# EAGLE design Omnetics resistor phantom (EAGLE 7.2.0)
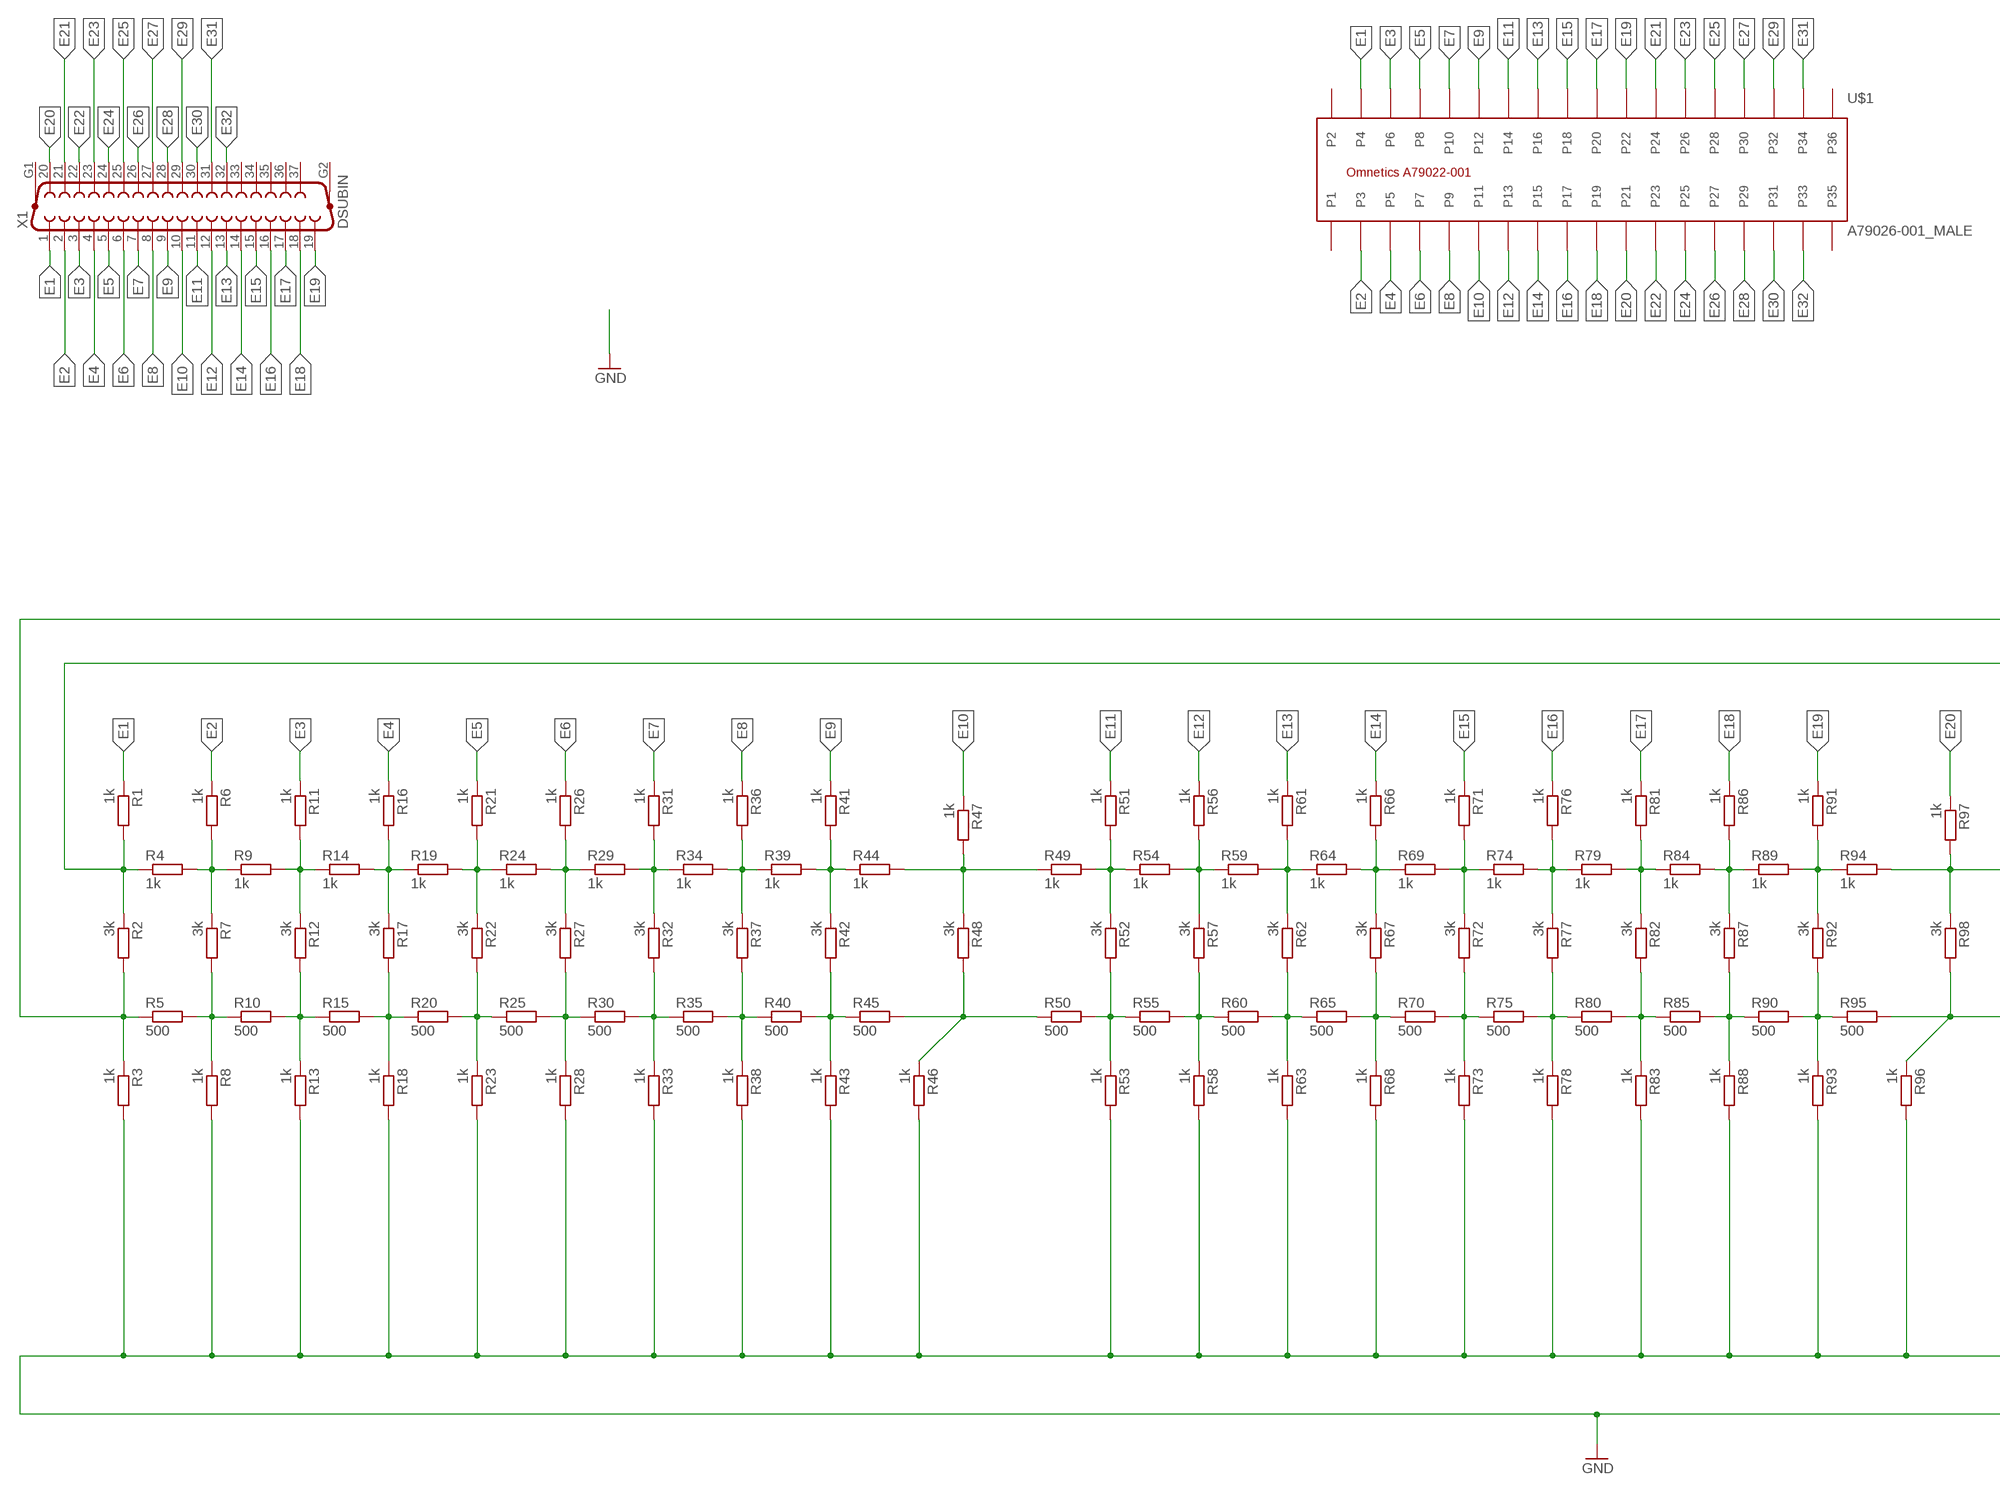
[diagram p0: schematic, sheet 1, part 1 of 2]
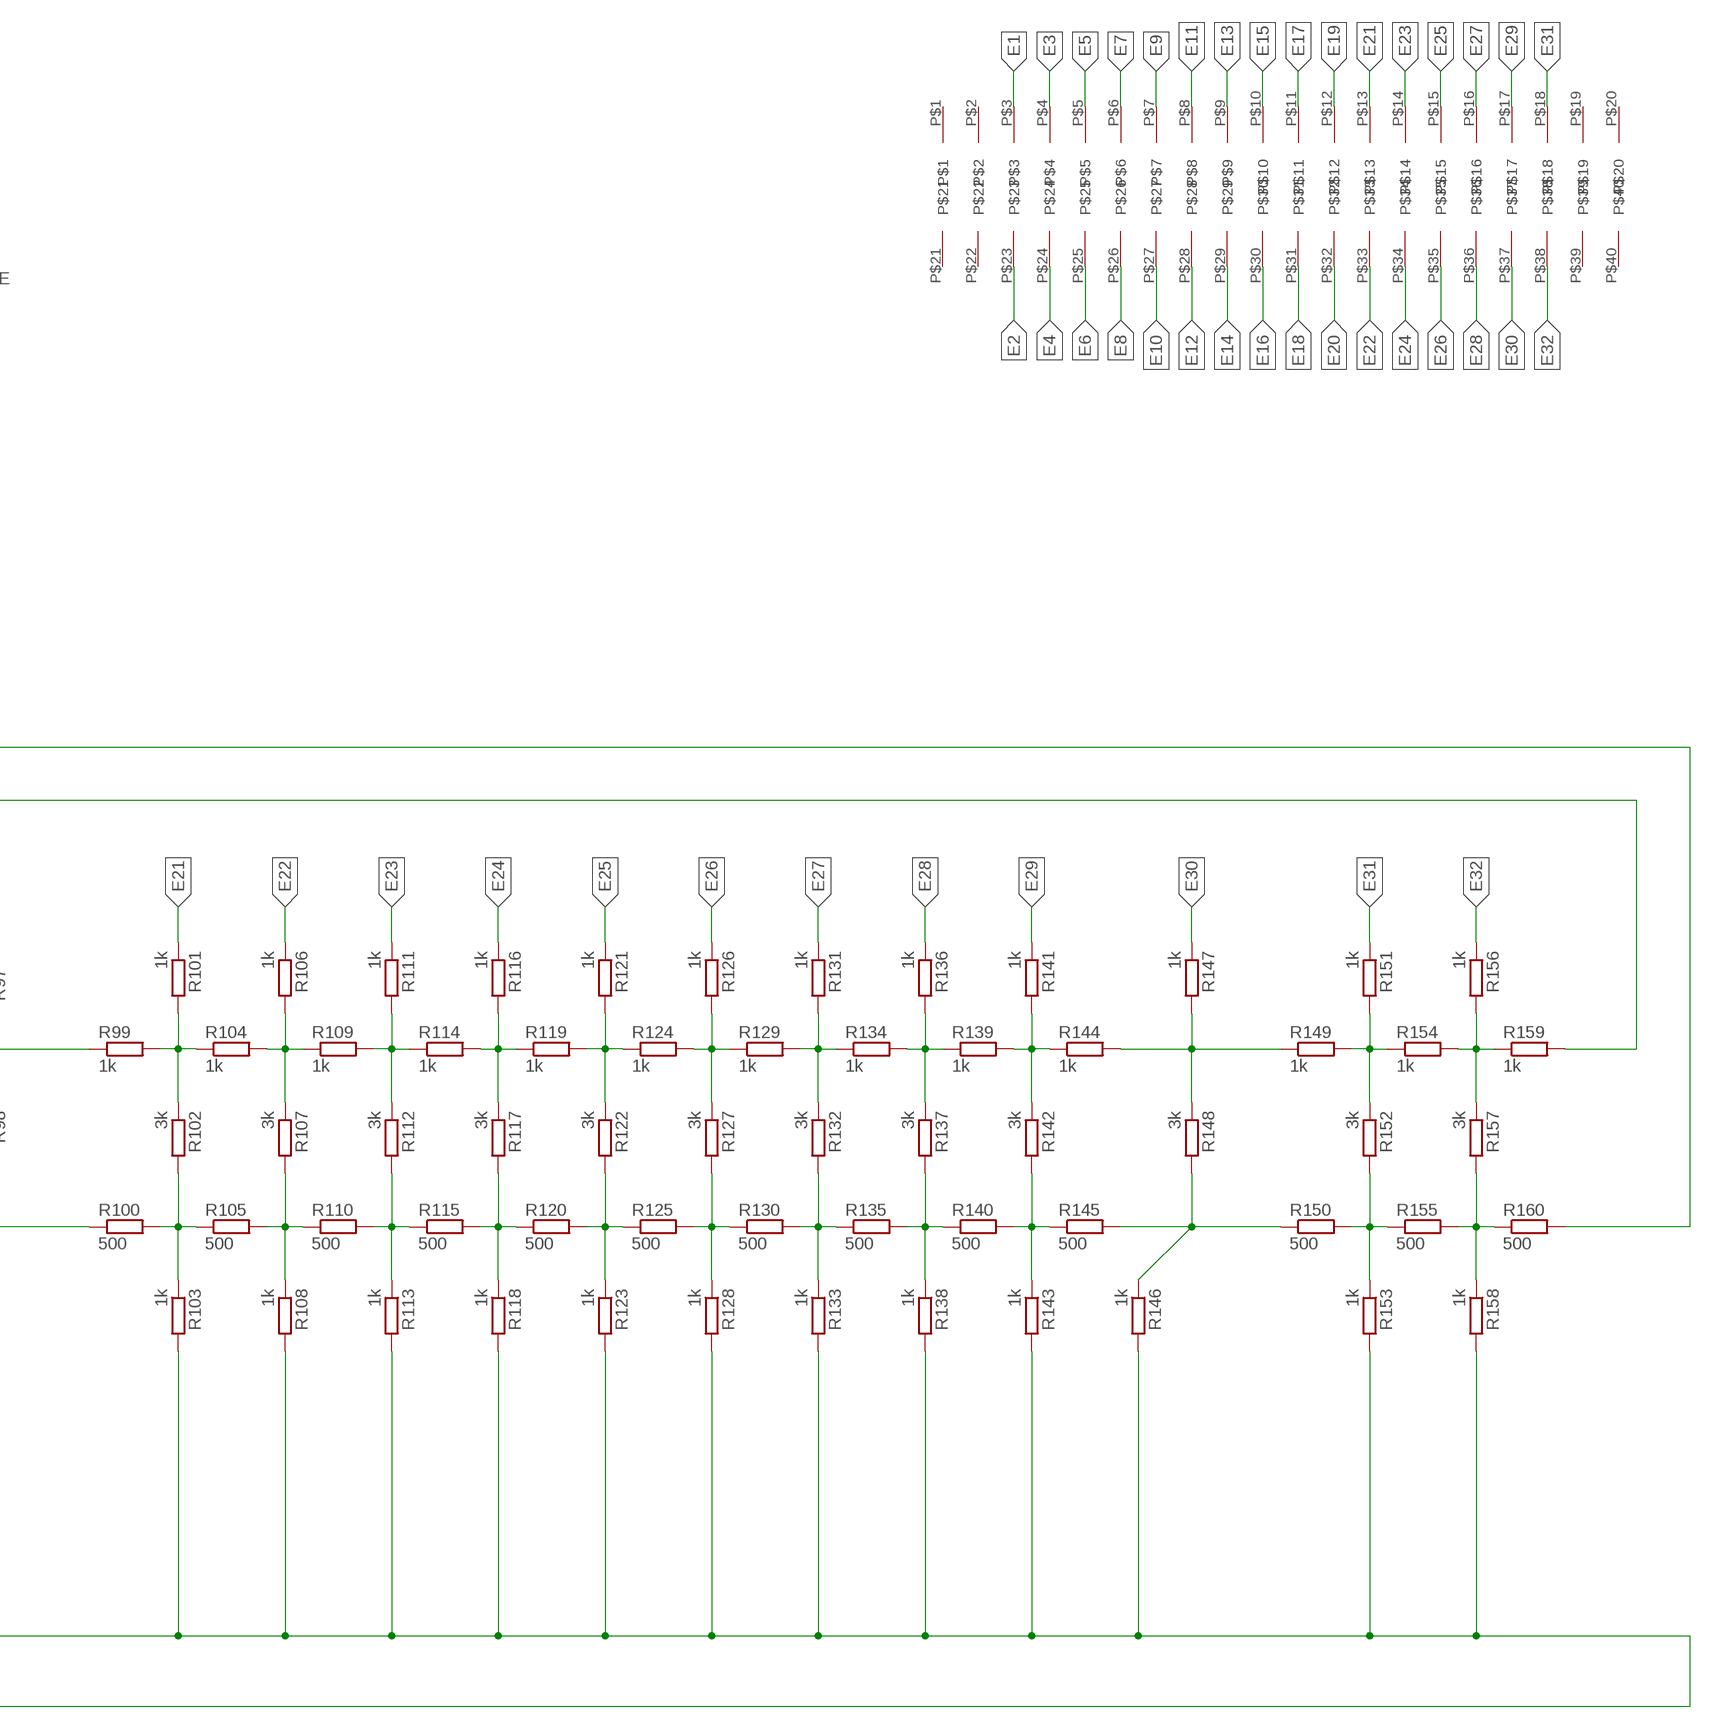
[diagram p1: schematic, sheet 1, part 2 of 2]

## Parts
R1  1k  R-EU_R0402  [R0402]
R2  3k  R-EU_R0402  [R0402]
R3  1k  R-EU_R0402  [R0402]
R4  1k  R-EU_R0402  [R0402]
R5  500  R-EU_R0402  [R0402]
R6  1k  R-EU_R0402  [R0402]
R7  3k  R-EU_R0402  [R0402]
R8  1k  R-EU_R0402  [R0402]
R9  1k  R-EU_R0402  [R0402]
R10  500  R-EU_R0402  [R0402]
R11  1k  R-EU_R0402  [R0402]
R12  3k  R-EU_R0402  [R0402]
R13  1k  R-EU_R0402  [R0402]
R14  1k  R-EU_R0402  [R0402]
R15  500  R-EU_R0402  [R0402]
R16  1k  R-EU_R0402  [R0402]
R17  3k  R-EU_R0402  [R0402]
R18  1k  R-EU_R0402  [R0402]
R19  1k  R-EU_R0402  [R0402]
R20  500  R-EU_R0402  [R0402]
R21  1k  R-EU_R0402  [R0402]
R22  3k  R-EU_R0402  [R0402]
R23  1k  R-EU_R0402  [R0402]
R24  1k  R-EU_R0402  [R0402]
R25  500  R-EU_R0402  [R0402]
R26  1k  R-EU_R0402  [R0402]
R27  3k  R-EU_R0402  [R0402]
R28  1k  R-EU_R0402  [R0402]
R29  1k  R-EU_R0402  [R0402]
R30  500  R-EU_R0402  [R0402]
R31  1k  R-EU_R0402  [R0402]
R32  3k  R-EU_R0402  [R0402]
R33  1k  R-EU_R0402  [R0402]
R34  1k  R-EU_R0402  [R0402]
R35  500  R-EU_R0402  [R0402]
R36  1k  R-EU_R0402  [R0402]
R37  3k  R-EU_R0402  [R0402]
R38  1k  R-EU_R0402  [R0402]
R39  1k  R-EU_R0402  [R0402]
R40  500  R-EU_R0402  [R0402]
R41  1k  R-EU_R0402  [R0402]
R42  3k  R-EU_R0402  [R0402]
R43  1k  R-EU_R0402  [R0402]
R44  1k  R-EU_R0402  [R0402]
R45  500  R-EU_R0402  [R0402]
R46  1k  R-EU_R0402  [R0402]
R47  1k  R-EU_R0402  [R0402]
R48  3k  R-EU_R0402  [R0402]
R49  1k  R-EU_R0402  [R0402]
R50  500  R-EU_R0402  [R0402]
R51  1k  R-EU_R0402  [R0402]
R52  3k  R-EU_R0402  [R0402]
R53  1k  R-EU_R0402  [R0402]
R54  1k  R-EU_R0402  [R0402]
R55  500  R-EU_R0402  [R0402]
R56  1k  R-EU_R0402  [R0402]
R57  3k  R-EU_R0402  [R0402]
R58  1k  R-EU_R0402  [R0402]
R59  1k  R-EU_R0402  [R0402]
R60  500  R-EU_R0402  [R0402]
R61  1k  R-EU_R0402  [R0402]
R62  3k  R-EU_R0402  [R0402]
R63  1k  R-EU_R0402  [R0402]
R64  1k  R-EU_R0402  [R0402]
R65  500  R-EU_R0402  [R0402]
R66  1k  R-EU_R0402  [R0402]
R67  3k  R-EU_R0402  [R0402]
R68  1k  R-EU_R0402  [R0402]
R69  1k  R-EU_R0402  [R0402]
R70  500  R-EU_R0402  [R0402]
R71  1k  R-EU_R0402  [R0402]
R72  3k  R-EU_R0402  [R0402]
R73  1k  R-EU_R0402  [R0402]
R74  1k  R-EU_R0402  [R0402]
R75  500  R-EU_R0402  [R0402]
R76  1k  R-EU_R0402  [R0402]
R77  3k  R-EU_R0402  [R0402]
R78  1k  R-EU_R0402  [R0402]
R79  1k  R-EU_R0402  [R0402]
R80  500  R-EU_R0402  [R0402]
R81  1k  R-EU_R0402  [R0402]
R82  3k  R-EU_R0402  [R0402]
R83  1k  R-EU_R0402  [R0402]
R84  1k  R-EU_R0402  [R0402]
R85  500  R-EU_R0402  [R0402]
R86  1k  R-EU_R0402  [R0402]
R87  3k  R-EU_R0402  [R0402]
R88  1k  R-EU_R0402  [R0402]
R89  1k  R-EU_R0402  [R0402]
R90  500  R-EU_R0402  [R0402]
R91  1k  R-EU_R0402  [R0402]
R92  3k  R-EU_R0402  [R0402]
R93  1k  R-EU_R0402  [R0402]
R94  1k  R-EU_R0402  [R0402]
R95  500  R-EU_R0402  [R0402]
R96  1k  R-EU_R0402  [R0402]
R97  1k  R-EU_R0402  [R0402]
R98  3k  R-EU_R0402  [R0402]
R99  1k  R-EU_R0402  [R0402]
R100  500  R-EU_R0402  [R0402]
R101  1k  R-EU_R0402  [R0402]
R102  3k  R-EU_R0402  [R0402]
R103  1k  R-EU_R0402  [R0402]
R104  1k  R-EU_R0402  [R0402]
R105  500  R-EU_R0402  [R0402]
R106  1k  R-EU_R0402  [R0402]
R107  3k  R-EU_R0402  [R0402]
R108  1k  R-EU_R0402  [R0402]
R109  1k  R-EU_R0402  [R0402]
R110  500  R-EU_R0402  [R0402]
R111  1k  R-EU_R0402  [R0402]
R112  3k  R-EU_R0402  [R0402]
R113  1k  R-EU_R0402  [R0402]
R114  1k  R-EU_R0402  [R0402]
R115  500  R-EU_R0402  [R0402]
R116  1k  R-EU_R0402  [R0402]
R117  3k  R-EU_R0402  [R0402]
R118  1k  R-EU_R0402  [R0402]
R119  1k  R-EU_R0402  [R0402]
R120  500  R-EU_R0402  [R0402]
R121  1k  R-EU_R0402  [R0402]
R122  3k  R-EU_R0402  [R0402]
R123  1k  R-EU_R0402  [R0402]
R124  1k  R-EU_R0402  [R0402]
R125  500  R-EU_R0402  [R0402]
R126  1k  R-EU_R0402  [R0402]
R127  3k  R-EU_R0402  [R0402]
R128  1k  R-EU_R0402  [R0402]
R129  1k  R-EU_R0402  [R0402]
R130  500  R-EU_R0402  [R0402]
R131  1k  R-EU_R0402  [R0402]
R132  3k  R-EU_R0402  [R0402]
R133  1k  R-EU_R0402  [R0402]
R134  1k  R-EU_R0402  [R0402]
R135  500  R-EU_R0402  [R0402]
R136  1k  R-EU_R0402  [R0402]
R137  3k  R-EU_R0402  [R0402]
R138  1k  R-EU_R0402  [R0402]
R139  1k  R-EU_R0402  [R0402]
R140  500  R-EU_R0402  [R0402]
R141  1k  R-EU_R0402  [R0402]
R142  3k  R-EU_R0402  [R0402]
R143  1k  R-EU_R0402  [R0402]
R144  1k  R-EU_R0402  [R0402]
R145  500  R-EU_R0402  [R0402]
R146  1k  R-EU_R0402  [R0402]
R147  1k  R-EU_R0402  [R0402]
R148  3k  R-EU_R0402  [R0402]
R149  1k  R-EU_R0402  [R0402]
R150  500  R-EU_R0402  [R0402]
R151  1k  R-EU_R0402  [R0402]
R152  3k  R-EU_R0402  [R0402]
R153  1k  R-EU_R0402  [R0402]
R154  1k  R-EU_R0402  [R0402]
R155  500  R-EU_R0402  [R0402]
R156  1k  R-EU_R0402  [R0402]
R157  3k  R-EU_R0402  [R0402]
R158  1k  R-EU_R0402  [R0402]
R159  1k  R-EU_R0402  [R0402]
R160  500  R-EU_R0402  [R0402]
U$1  A79026-001_MALE  [A79026-001_MALE]
U$2  SAMTEC_FTSH_LARGEPAD  [SAMTEC-FTSH-LARGEPAD]
X1  DSUBIN  F37VP  [F37VP]

## Nets
E1: R1.1 U$1.P4 U$2.P$3 X1.1
E2: R6.1 U$1.P3 U$2.P$23 X1.2
E3: R11.1 U$1.P6 U$2.P$4 X1.3
E4: R16.1 U$1.P5 U$2.P$24 X1.4
E5: R21.1 U$1.P8 U$2.P$5 X1.5
E6: R26.1 U$1.P7 U$2.P$25 X1.6
E7: R31.1 U$1.P10 U$2.P$6 X1.7
E8: R36.1 U$1.P9 U$2.P$26 X1.8
E9: R41.1 U$1.P12 U$2.P$7 X1.9
E10: R47.1 U$1.P11 U$2.P$27 X1.10
E11: R51.1 U$1.P14 U$2.P$8 X1.11
E12: R56.1 U$1.P13 U$2.P$28 X1.12
E13: R61.1 U$1.P16 U$2.P$9 X1.13
E14: R66.1 U$1.P15 U$2.P$29 X1.14
E15: R71.1 U$1.P18 U$2.P$10 X1.15
E16: R76.1 U$1.P17 U$2.P$30 X1.16
E17: R81.1 U$1.P20 U$2.P$11 X1.17
E18: R86.1 U$1.P19 U$2.P$31 X1.18
E19: R91.1 U$1.P22 U$2.P$12 X1.19
E20: R97.1 U$1.P21 U$2.P$32 X1.20
E21: R101.1 U$1.P24 U$2.P$13 X1.21
E22: R106.1 U$1.P23 U$2.P$33 X1.22
E23: R111.1 U$1.P26 U$2.P$14 X1.23
E24: R116.1 U$1.P25 U$2.P$34 X1.24
E25: R121.1 U$1.P28 U$2.P$15 X1.25
E26: R126.1 U$1.P27 U$2.P$35 X1.26
E27: R131.1 U$1.P30 U$2.P$16 X1.27
E28: R136.1 U$1.P29 U$2.P$36 X1.28
E29: R141.1 U$1.P32 U$2.P$17 X1.29
E30: R147.1 U$1.P31 U$2.P$37 X1.30
E31: R151.1 U$1.P34 U$2.P$18 X1.31
E32: R156.1 U$1.P33 U$2.P$38 X1.32
E38: R1.2 R2.1 R4.1 R159.2
E39: R4.2 R6.2 R7.1 R9.1
E40: R9.2 R11.2 R12.1 R14.1
E41: R14.2 R16.2 R17.1 R19.1
E42: R19.2 R21.2 R22.1 R24.1
E43: R24.2 R26.2 R27.1 R29.1
E44: R29.2 R31.2 R32.1 R34.1
E45: R34.2 R36.2 R37.1 R39.1
E46: R39.2 R41.2 R42.1 R44.1
E47: R44.2 R47.2 R48.1 R49.1
E48: R49.2 R51.2 R52.1 R54.1
E49: R54.2 R56.2 R57.1 R59.1
E50: R59.2 R61.2 R62.1 R64.1
E51: R64.2 R66.2 R67.1 R69.1
E52: R69.2 R71.2 R72.1 R74.1
E53: R74.2 R76.2 R77.1 R79.1
E54: R79.2 R81.2 R82.1 R84.1
E55: R84.2 R86.2 R87.1 R89.1
E56: R89.2 R91.2 R92.1 R94.1
E57: R94.2 R97.2 R98.1 R99.1
E58: R99.2 R101.2 R102.1 R104.1
E59: R104.2 R106.2 R107.1 R109.1
E60: R109.2 R111.2 R112.1 R114.1
E61: R114.2 R116.2 R117.1 R119.1
E63: R124.2 R126.2 R127.1 R129.1
E64: R129.2 R131.2 R132.1 R134.1
E65: R134.2 R136.2 R137.1 R139.1
E66: R139.2 R141.2 R142.1 R144.1
E67: R144.2 R147.2 R148.1 R149.1
E68: R149.2 R151.2 R152.1 R154.1
E69: R154.2 R156.2 R157.1 R159.1
GND: R3.2 R8.2 R13.2 R18.2 R23.2 R28.2 R33.2 R38.2 R43.2 R46.2 R53.2 R58.2 R63.2 R68.2 R73.2 R78.2 R83.2 R88.2 R93.2 R96.2 R103.2 R108.2 R113.2 R118.2 R123.2 R128.2 R133.2 R138.2 R143.2 R146.2 R153.2 R158.2
N$1: R119.2 R121.2 R122.1 R124.1
N$2: R2.2 R3.1 R5.1 R160.2
N$3: R5.2 R7.2 R8.1 R10.1
N$4: R10.2 R12.2 R13.1 R15.1
N$5: R15.2 R17.2 R18.1 R20.1
N$6: R20.2 R22.2 R23.1 R25.1
N$7: R25.2 R27.2 R28.1 R30.1
N$8: R30.2 R32.2 R33.1 R35.1
N$9: R35.2 R37.2 R38.1 R40.1
N$10: R40.2 R42.2 R43.1 R45.1
N$12: R50.2 R52.2 R53.1 R55.1
N$13: R55.2 R57.2 R58.1 R60.1
N$14: R60.2 R62.2 R63.1 R65.1
N$15: R65.2 R67.2 R68.1 R70.1
N$16: R70.2 R72.2 R73.1 R75.1
N$17: R75.2 R77.2 R78.1 R80.1
N$18: R80.2 R82.2 R83.1 R85.1
N$19: R85.2 R87.2 R88.1 R90.1
N$20: R90.2 R92.2 R93.1 R95.1
N$22: R100.2 R102.2 R103.1 R105.1
N$23: R105.2 R107.2 R108.1 R110.1
N$24: R110.2 R112.2 R113.1 R115.1
N$25: R115.2 R117.2 R118.1 R120.1
N$26: R120.2 R122.2 R123.1 R125.1
N$28: R125.2 R127.2 R128.1 R130.1
N$29: R130.2 R132.2 R133.1 R135.1
N$30: R135.2 R137.2 R138.1 R140.1
N$31: R140.2 R142.2 R143.1 R145.1
N$33: R150.2 R152.2 R153.1 R155.1
N$34: R155.2 R157.2 R158.1 R160.1
SW_IN1: R45.2 R46.1 R48.2 R50.1
SW_IN2: R95.2 R96.1 R98.2 R100.1
SW_IN3: R145.2 R146.1 R148.2 R150.1
Unconnected: U$1.P1 U$1.P2 U$1.P35 U$1.P36 U$2.P$1 U$2.P$2 U$2.P$19 U$2.P$20 U$2.P$21 U$2.P$22 U$2.P$39 U$2.P$40 X1.33 X1.34 X1.35 X1.36 X1.37 X1.G1 X1.G2

## Library data of the parts
R1-R160 = rcl:R-EU_: RESISTOR, European symbol
U$1 = omnetics:A79026-001_MALE
U$2 = mayo:SAMTEC_FTSH_LARGEPAD
X1 = con-subd:F37VP: SUB-D; OC_FARNELL: unknown; OC_NEWARK: unknown

## Board
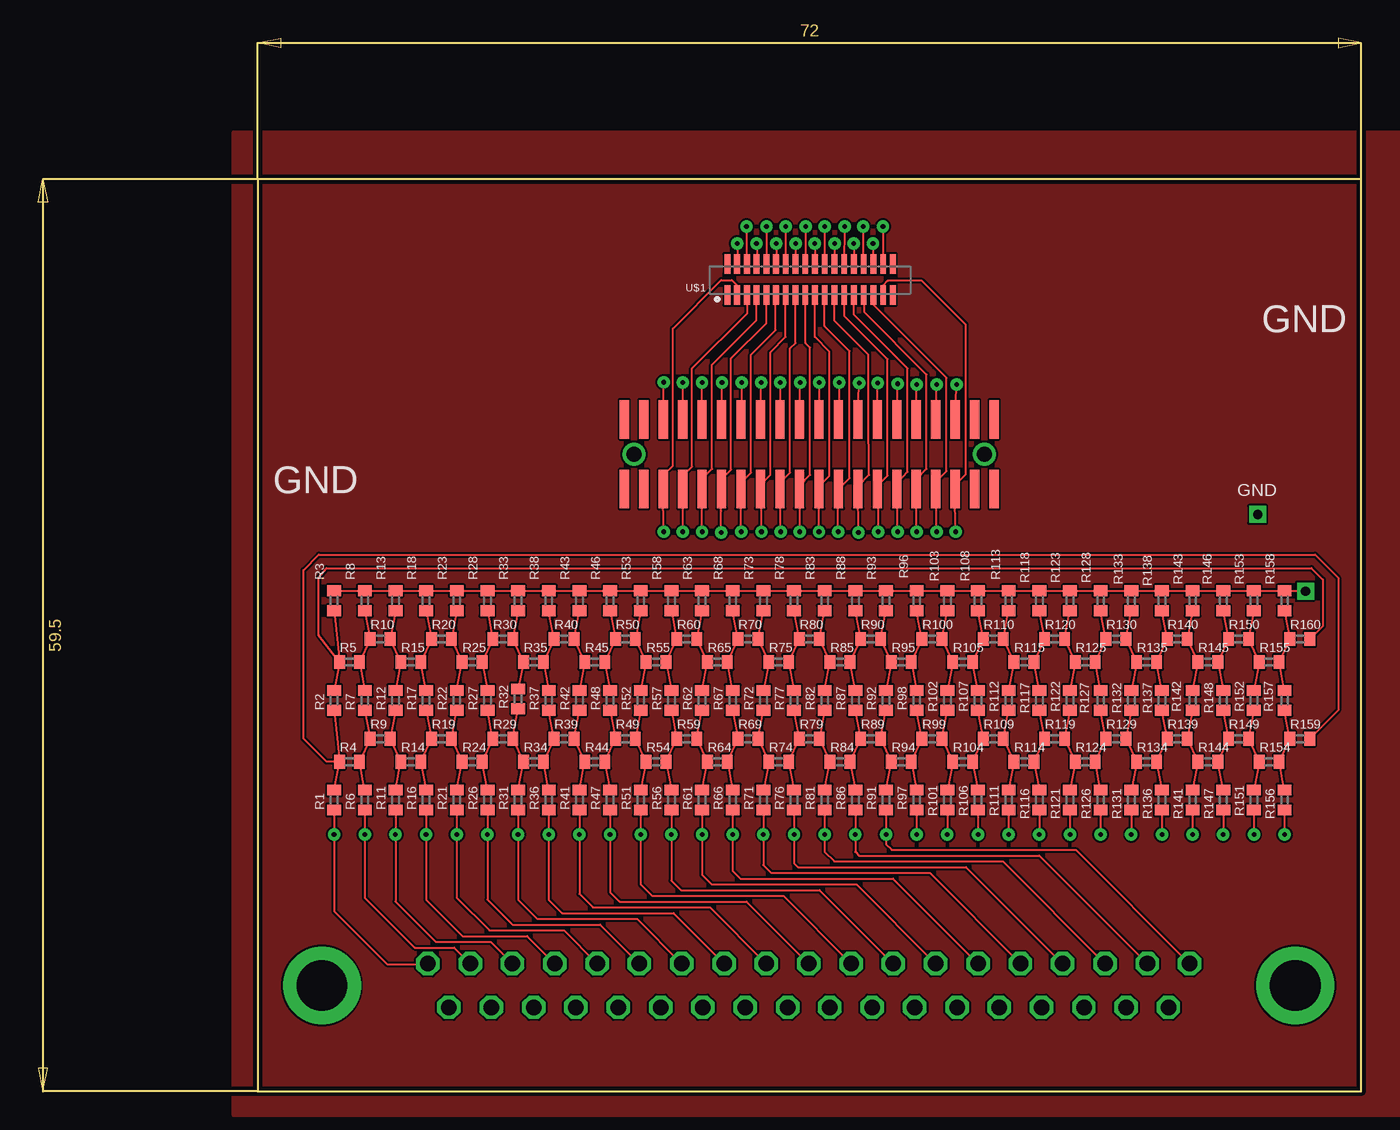
[diagram p2: board, top side]
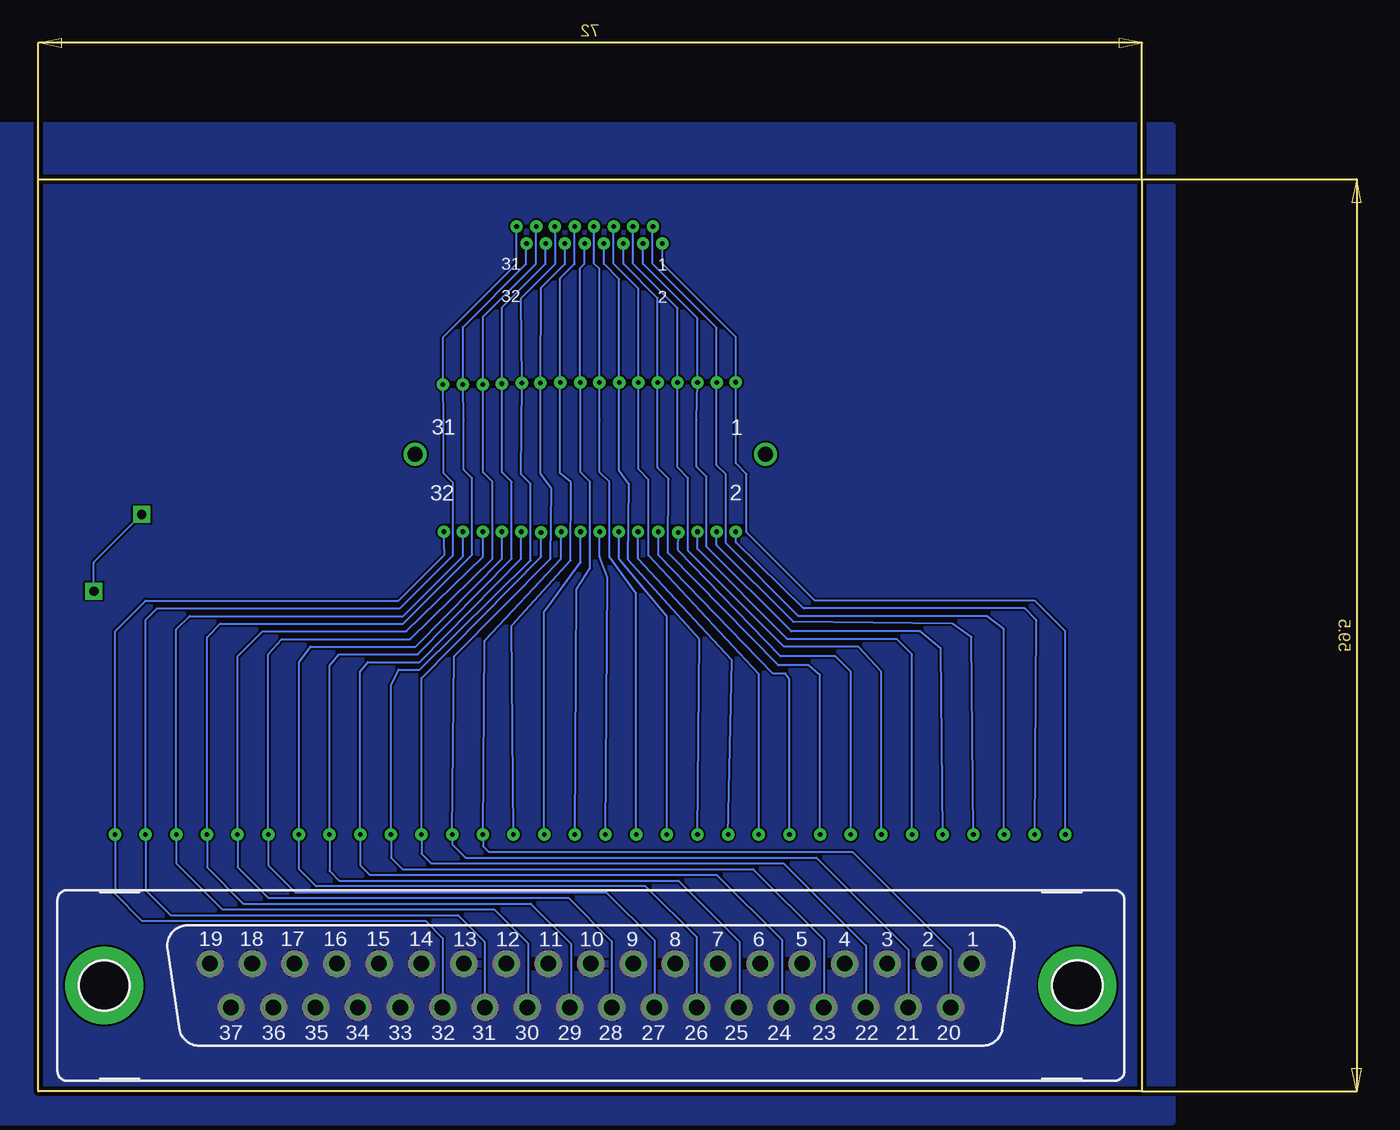
[diagram p3: board, bottom side, seen from below]

Size 72 x 59.5 mm. Coordinates in mm from the lower left corner, seen from the top.
Outline: 0,59.5 0,0 72,0 72,59.5 0,59.5
Copper layers (1*16): Top 0.035mm / dielectric 1.5mm / Bottom 0.035mm
Design rules "pcbtrain": minimum track width 0.125mm, minimum drill 0.2mm, track to track 0.125mm, track to pad 0.125mm, pad to pad 0.125mm, via to via 0.125mm, smd to smd 0mil, copper to edge 0.25mm, drill to drill 0.2mm, minimum pad ring 10mil, minimum via ring 10mil, stop-mask expansion 0.125mm, vias tented up to drill 0mil, thermal gap 10mil

### Footprints (pad centres in the part's own frame; a part is rotated, then mirrored left to right if it is on the bottom)
R0402 = smd 0.7 x 0.9: 1 -0.65,0; 2 0.65,0
A79026-001_MALE = smd 0.381 x 1.27: P1 -5.397,-1.016; P2 -5.397,1.016; P3 -4.763,-1.016; P4 -4.763,1.016; P5 -4.128,-1.016; P6 -4.128,1.016; P7 -3.493,-1.016; P8 -3.493,1.016; P9 -2.857,-1.016; P10 -2.857,1.016; P11 -2.223,-1.016; P12 -2.223,1.016; P13 -1.587,-1.016; P14 -1.587,1.016; P15 -0.953,-1.016; P16 -0.953,1.016; P17 -0.318,-1.016; P18 -0.318,1.016; P19 0.318,-1.016; P20 0.318,1.016; P21 0.953,-1.016; P22 0.953,1.016; P23 1.587,-1.016; P24 1.587,1.016; P25 2.223,-1.016; P26 2.223,1.016; P27 2.857,-1.016; P28 2.857,1.016; P29 3.493,-1.016; P30 3.493,1.016; P31 4.128,-1.016; P32 4.128,1.016; P33 4.763,-1.016; P34 4.763,1.016; P35 5.397,-1.016; P36 5.397,1.016
SAMTEC-FTSH-LARGEPAD = smd 0.6 x 2.5: P$1 -23,7; P$2 -21.73,7; P$3 -20.46,7; P$4 -19.19,7; P$5 -17.92,7; P$6 -16.65,7; P$7 -15.38,7; P$8 -14.11,7; P$9 -12.84,7; P$10 -11.57,7; P$11 -10.3,7; P$12 -9.03,7; P$13 -7.76,7; P$14 -6.49,7; P$15 -5.22,7; P$16 -3.95,7; P$17 -2.68,7; P$18 -1.41,7; P$19 -0.14,7; P$20 1.13,7; P$21 -23,2.45; P$22 -21.73,2.45; P$23 -20.46,2.45; P$24 -19.19,2.45; P$25 -17.92,2.45; P$26 -16.65,2.45; P$27 -15.38,2.45; P$28 -14.11,2.45; P$29 -12.84,2.45; P$30 -11.57,2.45; P$31 -10.3,2.45; P$32 -9.03,2.45; P$33 -7.76,2.45; P$34 -6.49,2.45; P$35 -5.22,2.45; P$36 -3.95,2.45; P$37 -2.68,2.45; P$38 -1.41,2.45; P$39 -0.14,2.45; P$40 1.13,2.45 | drill 1: P$41 -22.365,4.725; P$42 0.495,4.725
F37VP = drill 1.016 octagon: 1 24.841,1.422; 2 22.073,1.422; 3 19.329,1.422; 4 16.561,1.422; 5 13.792,1.422; 6 11.049,1.422; 7 8.28,1.422; 8 5.512,1.422; 9 2.769,1.422; 10 0,1.422; 11 -2.769,1.422; 12 -5.512,1.422; 13 -8.28,1.422; 14 -11.049,1.422; 15 -13.818,1.422; 16 -16.561,1.422; 17 -19.329,1.422; 18 -22.098,1.422; 19 -24.841,1.422; 20 23.47,-1.422; 21 20.701,-1.422; 22 17.932,-1.422; 23 15.189,-1.422; 24 12.421,-1.422; 25 9.652,-1.422; 26 6.909,-1.422; 27 4.14,-1.422; 28 1.372,-1.422; 29 -1.372,-1.422; 30 -4.14,-1.422; 31 -6.909,-1.422; 32 -9.677,-1.422; 33 -12.421,-1.422; 34 -15.189,-1.422; 35 -17.958,-1.422; 36 -20.701,-1.422; 37 -23.47,-1.422 | drill 3.302 pad 5.08: G1 -31.75,0; G2 31.75,0

### Placement (x,y rotation side)
R1  5,19 90 top
R2  5,25.5 90 top
R3  5,32 90 top
R4  6,21.5 0 top
R5  6,28 0 top
R6  7,19 90 top
R7  7,25.5 90 top
R8  7,32 90 top
R9  8,23 0 top
R10  8,29.5 0 top
R11  9,19 90 top
R12  9,25.5 90 top
R13  9,32 90 top
R14  10,21.5 0 top
R15  10,28 0 top
R16  11,19 90 top
R17  11,25.5 90 top
R18  11,32 90 top
R19  12,23 0 top
R20  12,29.5 0 top
R21  13,19 90 top
R22  13,25.5 90 top
R23  13,32 90 top
R24  14,21.5 0 top
R25  14,28 0 top
R26  15,19 90 top
R27  15,25.5 90 top
R28  15,32 90 top
R29  16,23 0 top
R30  16,29.5 0 top
R31  17,19 90 top
R32  17,25.6 90 top
R33  17,32 90 top
R34  18,21.5 0 top
R35  18,28 0 top
R36  19,19 90 top
R37  19,25.5 90 top
R38  19,32 90 top
R39  20,23 0 top
R40  20,29.5 0 top
R41  21,19 90 top
R42  21,25.5 90 top
R43  21,32 90 top
R44  22,21.5 0 top
R45  22,28 0 top
R46  23,32 90 top
R47  23,19 90 top
R48  23,25.5 90 top
R49  24,23 0 top
R50  24,29.5 0 top
R51  25,19 90 top
R52  25,25.5 90 top
R53  25,32 90 top
R54  26,21.5 0 top
R55  26,28 0 top
R56  27,19 90 top
R57  27,25.5 90 top
R58  27,32 90 top
R59  28,23 0 top
R60  28,29.5 0 top
R61  29,19 90 top
R62  29,25.5 90 top
R63  29,32 90 top
R64  30,21.5 0 top
R65  30,28 0 top
R66  31,19 90 top
R67  31,25.5 90 top
R68  31,32 90 top
R69  32,23 0 top
R70  32,29.5 0 top
R71  33,19 90 top
R72  33,25.5 90 top
R73  33,32 90 top
R74  34,21.5 0 top
R75  34,28 0 top
R76  35,19 90 top
R77  35,25.5 90 top
R78  35,32 90 top
R79  36,23 0 top
R80  36,29.5 0 top
R81  37,19 90 top
R82  37,25.5 90 top
R83  37,32 90 top
R84  38,21.5 0 top
R85  38,28 0 top
R86  39,19 90 top
R87  39,25.5 90 top
R88  39,32 90 top
R89  40,23 0 top
R90  40,29.5 0 top
R91  41,19 90 top
R92  41,25.5 90 top
R93  41,32 90 top
R94  42,21.5 0 top
R95  42,28 0 top
R96  43,32 90 top
R97  43,19 90 top
R98  43,25.5 90 top
R99  44,23 0 top
R100  44,29.5 0 top
R101  45,19 90 top
R102  45,25.5 90 top
R103  45,32 90 top
R104  46,21.5 0 top
R105  46,28 0 top
R106  47,19 90 top
R107  47,25.5 90 top
R108  47,32 90 top
R109  48,23 0 top
R110  48,29.5 0 top
R111  49,19 90 top
R112  49,25.5 90 top
R113  49,32 90 top
R114  50,21.5 0 top
R115  50,28 0 top
R116  51,19 90 top
R117  51,25.5 90 top
R118  51,32 90 top
R119  52,23 0 top
R120  52,29.5 0 top
R121  53,19 90 top
R122  53,25.5 90 top
R123  53,32 90 top
R124  54,21.5 0 top
R125  54,28 0 top
R126  55,19 90 top
R127  55,25.5 90 top
R128  55,32 90 top
R129  56,23 0 top
R130  56,29.5 0 top
R131  57,19 90 top
R132  57,25.5 90 top
R133  57,32 90 top
R134  58,21.5 0 top
R135  58,28 0 top
R136  59,19 90 top
R137  59,25.5 90 top
R138  59,32 90 top
R139  60,23 0 top
R140  60,29.5 0 top
R141  61,19 90 top
R142  61,25.5 90 top
R143  61,32 90 top
R144  62,21.5 0 top
R145  62,28 0 top
R146  63,32 90 top
R147  63,19 90 top
R148  63,25.5 90 top
R149  64,23 0 top
R150  64,29.5 0 top
R151  65,19 90 top
R152  65,25.5 90 top
R153  65,32 90 top
R154  66,21.5 0 top
R155  66,28 0 top
R156  67,19 90 top
R157  67,25.5 90 top
R158  67,32 90 top
R159  68,23 0 top
R160  68,29.5 0 top
U$1  36.05,52.95 0 top
U$2  46.92,36.83 0 top
X1  35.95,6.91 0 bottom

### Tracks (layer width: path | path; a pad name or v marks a point on that pad's centre or on a via)
E1  (via drill 0.3)
  Top 0.125: U$2.P$3 v26.5,46.25 | v31.3,55.3 U$1.P4 | R1.1 v5,16.75 5,11.75 8.45,8.3 11.08,8.3 X1.1
  Bottom 0.125: v31.3,55.3 31.29,55.29 U$1.P4 26.5,49.18 v26.5,46.25 26.5,40.95 25.8,40.25 25.8,36.45 21.35,32 7,32 5,30 v5,16.75
E2  (via drill 0.3)
  Top 0.125: U$1.P3 31.3,51.95 31.3,52.55 30.95,52.9 30.25,52.9 27.1,49.75 27.1,40.8 26.5,40.2 U$2.P$23 v26.5,36.5 | R6.1 v7,16.75 7,12.62 10.25,9.38 12.84,9.38 X1.2
  Bottom 0.125: v7,16.75 6.88,30.72 7.65,31.5 22.07,31.5 26.5,35.8 v26.5,36.5
E3  (via drill 0.3)
  Top 0.125: U$2.P$4 27.77,43.83 v27.75,46.22 | 31.9,53.99 U$1.P6 31.92,56.38 v31.9,56.4 | R11.1 v9,16.75 9,12.38 11.62,9.75 15.2,9.75 X1.3
  Bottom 0.125: v31.9,56.4 31.92,56.38 U$1.P6 27.75,49.79 v27.75,46.22 27.75,40.85 27.15,40.25 27.15,35.75 22.4,31 10.12,31 9,30.12 v9,16.75
E4  (via drill 0.3)
  Top 0.125: R16.1 v11,16.75 11,12.5 13.38,10.12 17.6,10.12 X1.4 | v27.75,36.5 27.75,38.23 U$2.P$24 27.77,40.17 28.35,40.75 28.35,47.15 31.95,50.75 31.95,51.91 U$1.P5
  Bottom 0.125: v11,16.75 11.12,29.62 12.38,30.5 22.75,30.62 27.75,35.62 v27.75,36.5
E5  (via drill 0.3)
  Top 0.125: U$2.P$5 28.99,43.81 v29,46.22 | v32.55,55.3 32.6,54.01 U$1.P8 | R21.1 v13,16.75 13,12.62 15.12,10.5 19.99,10.5 X1.5
  Bottom 0.125: v32.55,55.3 32.56,55.21 U$1.P8 29,50.41 v29,46.22 29.05,43.8 29.05,40.75 28.4,40.1 28.4,35.53 22.88,30 14.5,30 13.12,28.88 v13,16.75
E6  (via drill 0.3)
  Top 0.125: R26.1 v15,16.75 15,12.5 16.62,10.88 22.36,10.88 X1.6 | v29,36.5 29,38.21 U$2.P$25 29.04,39.99 29.65,40.6 29.65,47.4 32.55,50.3 U$1.P7
  Bottom 0.125: v15,16.75 15,28.5 16,29.5 23.12,29.5 29,35.38 v29,36.5
E7  (via drill 0.3)
  Top 0.125: U$2.P$6 30.31,43.84 v30.3,46.22 | v33.2,56.4 U$1.P10 | R31.1 v17,16.75 17,12.5 18.25,11.25 24.75,11.25 X1.7
  Bottom 0.125: v33.2,56.4 v33.19,56.39 U$1.P10 30.3,51.07 v30.3,46.22 30.3,40.7 29.6,40 29.6,35.25 23.35,29 18.5,29 17,27.38 v17,16.75
E8  (via drill 0.3)
  Top 0.125: R36.1 v19,16.75 19,12.5 19.88,11.62 27.15,11.62 X1.8 | v30.25,36.45 30.25,37.86 U$2.P$26 30.31,39.96 30.9,40.55 30.9,47.8 33.2,50.1 U$1.P9
  Bottom 0.125: v19,16.75 19,27.38 20,28.38 23.57,28.38 30.27,35.3 v30.25,36.45
E9  (via drill 0.3)
  Top 0.125: U$2.P$7 31.58,43.83 v31.6,46.22 | v33.85,55.3 33.85,53.99 U$1.P12 | R41.1 v21,16.75 21,12.88 21.88,12 29.51,12 X1.9
  Bottom 0.125: v33.85,55.3 33.83,55.28 U$1.P12 31.6,51.74 v31.6,46.22 31.6,40.67 30.88,39.95 30.93,35.12 23.73,27.78 21.75,27.78 21,27.12 v21,16.75
E10  (via drill 0.3)
  Top 0.125: 33.85,51.91 U$1.P11 33.8,51.91 33.8,49.65 32.2,48.05 32.2,40.35 31.58,39.73 U$2.P$27 31.55,38.22 v31.55,36.5 | R47.1 v23,16.75 23,13 23.62,12.38 31.91,12.38 X1.10
  Bottom 0.125: v23,16.75 23,26.88 23.25,27.25 24.07,27.25 31.55,34.97 v31.55,36.5
E11  (via drill 0.3)
  Top 0.125: U$2.P$8 v32.85,46.22 | v34.45,56.4 U$1.P14 | R51.1 v25,16.75 25,13.5 25.75,12.75 34.3,12.75 X1.11
  Bottom 0.125: v34.45,56.4 34.46,56.39 U$1.P14 32.85,52.35 v32.85,46.22 32.85,40.58 32.2,39.88 32.2,34.95 25,27.2 v25,16.75
E12  (via drill 0.3)
  Top 0.125: R56.1 v27,16.75 27,13.75 27.62,13.12 36.67,13.12 X1.12 | v32.88,36.5 32.88,38.22 U$2.P$28 32.85,39.6 33.45,40.2 33.45,48.2 34.45,49.2 U$1.P13
  Bottom 0.125: v27,16.75 26.75,28.12 32.88,34.75 v32.88,36.5
E13  (via drill 0.3)
  Top 0.125: U$2.P$9 34.12,43.83 v34.1,46.22 | v35.1,55.3 U$1.P16 | R61.1 v29,16.75 29,14.12 29.62,13.5 39.06,13.5 X1.13
  Bottom 0.125: v35.1,55.3 35.1,55.25 U$1.P16 34.1,52.97 v34.1,46.22 34.12,43.83 34.12,40.5 33.45,39.6 33.52,34.67 28.88,29.5 v29,16.75
E14  (via drill 0.3)
  Top 0.125: R66.1 v31,16.75 31,14.38 31.5,13.88 41.46,13.88 X1.14 | v34.12,36.5 34.12,38.25 U$2.P$29 34.12,39.72 34.75,40.35 34.75,48.45 35.1,48.8 U$1.P15
  Bottom 0.125: v31,16.75 31,31 34.12,34.75 v34.12,36.5
E15  (via drill 0.3)
  Top 0.125: U$2.P$10 35.39,43.84 v35.4,46.22 | v35.75,56.4 U$1.P18 | R71.1 v33,16.75 33,14.75 33.5,14.25 43.85,14.25 X1.15
  Bottom 0.125: v35.75,56.4 U$1.P18 35.4,53.63 v35.4,46.22 35.38,43.83 35.38,40.38 34.75,39.75 34.75,34.88 33,32.5 v33,16.75
E16  (via drill 0.3)
  Top 0.125: R76.1 v35,16.75 35,14.88 35.25,14.62 46.22,14.62 X1.16 | v35.38,36.5 35.38,38.23 U$2.P$30 35.39,39.54 36.05,40.2 36.05,48.5 35.75,48.8 35.75,51.92 U$1.P17
  Bottom 0.125: v35,16.75 34.88,33.5 35.38,34.88 v35.38,36.5
E17  (via drill 0.3)
  Top 0.125: U$2.P$11 v36.65,46.22 | v36.35,55.3 36.35,53.98 U$1.P20 | R81.1 v37,16.75 37,15.62 37.62,15 48.61,15 X1.17
  Bottom 0.125: v36.35,55.3 36.37,55.28 U$1.P20 36.65,53.68 v36.65,46.22 36.62,46.15 36.62,40.38 36,39.75 36,34.12 36.88,32.75 v37,16.75
E18  (via drill 0.3)
  Top 0.125: R86.1 v39,16.75 39,15.62 39.25,15.38 51.01,15.38 X1.18 | v36.62,36.5 U$2.P$31 36.66,39.51 37.3,40.15 37.3,48.25 36.35,49.2 36.35,51.92 U$1.P19
  Bottom 0.125: v39,16.75 39,31.25 36.62,34.5 v36.62,36.5
E19  (via drill 0.3)
  Top 0.125: U$2.P$12 37.93,43.83 v37.95,46.22 | v37,56.4 37,54.07 U$1.P22 | R91.1 v41,16.75 41,16.12 41.38,15.75 53.37,15.75 X1.19
  Bottom 0.125: v37,56.4 37,56.25 U$1.P22 37.95,53.02 v37.95,46.22 37.95,40.3 37.25,39.72 37.27,34.62 41.12,30.38 v41,16.75
E20  (via drill 0.3)
  Top 0.125: 37,51.89 U$1.P21 37,49.9 38.62,48.28 38.62,40 37.93,39.31 U$2.P$32 37.88,38.19 v37.88,36.5 | R97.1 v43,16.75
  Bottom 0.125: v37.88,36.5 37.9,36.47 37.9,34.72 42.88,29.38 v43,16.75 43,16 42.62,15.62 18.88,15.62 12.5,9.25 12.5,5.5 X1.20
E21  (via drill 0.3)
  Top 0.125: U$2.P$13 v39.25,46.2 | v37.65,55.3 U$1.P24 | R101.1 v45,16.75
  Bottom 0.125: v37.65,55.3 37.64,54.99 U$1.P24 39.2,52.4 v39.25,46.2 39.25,40.28 38.52,39.35 38.58,34.75 44.88,28.38 v45,16.75 45,16.12 44.12,15.25 21.25,15.25 15.25,9.25 X1.21
E22  (via drill 0.3)
  Top 0.125: 37.65,51.77 U$1.P23 37.65,50.25 39.85,48.05 39.85,44.22 39.9,40.2 39.2,39.5 U$2.P$33 v39.2,36.45 | R106.1 v47,16.75
  Bottom 0.125: v39.2,36.45 39.2,34.88 47,26.95 v47,16.75 47,15.5 46.38,14.88 23.38,14.88 18,9.5 18,5.51 X1.22
E23  (via drill 0.3)
  Top 0.125: U$2.P$14 40.47,43.82 v40.45,46.2 | v38.3,56.4 38.25,53.99 U$1.P26 | R111.1 v49,16.75
  Bottom 0.125: v38.3,56.4 38.27,55.43 U$1.P26 40.5,51.74 v40.45,46.2 40.5,40.25 39.88,39.62 39.88,34.62 47.12,27.5 48.5,27.5 49,26.5 v49,16.75 49,15.25 48.25,14.5 25.38,14.5 20.75,9.88 20.75,5.5 X1.23
E24  (via drill 0.3)
  Top 0.125: 38.25,51.96 U$1.P25 38.3,51.91 38.3,50.55 41.1,47.75 41.1,40.15 40.47,39.52 U$2.P$34 40.5,38.22 v40.5,36.5 | R116.1 v51,16.75
  Bottom 0.125: v40.5,36.5 40.5,34.75 47.12,28 50.5,28 51,27.38 v51,16.75 51,14.75 50.38,14.12 27.75,14.12 23.5,9.88 23.5,5.52 X1.24
E25  (via drill 0.3)
  Top 0.125: U$2.P$15 41.74,43.49 v41.75,46.15 | v38.9,55.3 U$1.P28 | R121.1 v53,16.75
  Bottom 0.125: v38.9,55.3 v38.91,55.29 U$1.P28 41.75,51.12 v41.75,46.15 41.75,40.38 41.12,39.75 41.12,34.75 47.25,28.5 52.38,28.5 53,27.75 v53,16.75 53,14.38 52.38,13.75 30.25,13.75 26.25,9.75 26.25,5.54 X1.25
E26  (via drill 0.3)
  Top 0.125: R126.1 v55,16.75 | v41.75,36.5 41.75,38.24 U$2.P$35 41.74,39.69 42.4,40.4 42.4,47.15 38.9,50.65 U$1.P27
  Bottom 0.125: v41.75,36.5 41.75,34.75 47.38,29 54.25,29 55,28 v55,16.75 55,14.5 53.88,13.38 32.38,13.38 29.05,10.05 X1.26
E27  (via drill 0.3)
  Top 0.125: U$2.P$16 43.01,43.54 v43,46.1 | v39.5,56.4 39.5,54.01 U$1.P30 | R131.1 v57,16.75
  Bottom 0.125: v39.5,56.4 39.54,56.36 U$1.P30 43,50.51 v43,46.1 43,40.38 42.38,39.75 42.38,34.75 47.75,29.5 56.12,29.5 57,28.5 v57,16.75 57,14.75 55.25,13 34.95,13 31.8,9.85 31.8,5.5 X1.27
E28  (via drill 0.3)
  Top 0.125: U$1.P29 39.6,51.88 39.6,50.8 43.65,46.75 43.65,40.6 43.01,39.96 U$2.P$36 43,38.24 v43,36.5 | R136.1 v59,16.75
  Bottom 0.125: v43,36.5 43,34.88 48,30 57.38,30 59,28.38 v59,16.75 59,14.62 57,12.62 37.42,12.62 34.6,9.8 34.6,5.5 X1.28
E29  (via drill 0.3)
  Top 0.125: U$2.P$17 44.28,43.83 v44.3,46.1 | v40.15,55.3 40.15,53.99 U$1.P32 | R141.1 v61,16.75
  Bottom 0.125: v40.15,55.3 40.18,55.27 U$1.P32 44.3,49.84 v44.3,46.1 44.25,43.8 44.25,40.55 43.7,40 43.7,35 48.2,30.5 60.12,30.5 61,29.62 v61,16.75 61,14.62 58.62,12.25 39.88,12.25 37.25,9.62 37.25,5.56 X1.29
E30  (via drill 0.3)
  Top 0.125: U$1.P31 40.15,51.91 40.15,51.33 44.95,46.53 44.95,40.45 44.28,39.78 U$2.P$37 44.3,38.23 v44.3,36.5 | R147.1 v63,16.75
  Bottom 0.125: v44.3,36.5 44.3,34.9 48.2,31 62.12,31 63,30.12 v63,16.75 63,14.88 60,11.88 42.27,11.88 40.05,9.65 40.05,5.53 X1.30
E31  (via drill 0.3)
  Top 0.125: U$2.P$18 45.6,46.05 v45.6,46.1 | v40.8,56.4 U$1.P34 | R151.1 v65,16.75
  Bottom 0.125: v40.8,56.4 40.81,56.39 U$1.P34 45.6,49.18 v45.6,46.1 45.55,43.8 45.55,40.3 44.95,39.7 44.95,34.95 48.4,31.5 64.25,31.5 65,30.75 v65,16.75 65,13.12 63.38,11.5 44.62,11.5 42.88,9.75 42.88,5.5 X1.31
E32  (via drill 0.3)
  Top 0.125: U$1.P33 40.8,51.95 40.8,52.55 41.1,52.85 43.35,52.85 46.2,50 46.2,40.25 45.55,39.6 U$2.P$38 45.5,38.2 v45.55,36.5 | R156.1 v67,16.75
  Bottom 0.125: v45.55,36.5 45.5,35 48.5,32 65,32 67,30 v67,16.75 67,12.88 65.25,11.12 46.75,11.12 45.62,10 X1.32
E38
  Top 0.125: R2.1 R4.1 | R1.2 R4.1 | R4.1 4.5,21.5 3,23 3,34 4,35 69,35 70.5,33.5 70.5,24.85 R159.2
E39
  Top 0.125: R7.1 R9.1 R4.2 R6.2
E40
  Top 0.125: R12.1 R9.2 R14.1 R11.2
E41
  Top 0.125: R17.1 R19.1 R14.2 R16.2
E42
  Top 0.125: R21.2 R24.1 R19.2 R22.1
E43
  Top 0.125: R27.1 R29.1 R24.2 R26.2
E44
  Top 0.125: R32.1 R29.2 R34.1 R31.2
E45
  Top 0.125: R37.1 R39.1 R34.2 R36.2
E46
  Top 0.125: R42.1 R39.2 R44.1 R41.2
E47
  Top 0.125: R48.1 R49.1 R44.2 R47.2
E48
  Top 0.125: R52.1 R49.2 R54.1 R51.2
E49
  Top 0.125: R56.2 R54.2 R59.1 R57.1
E50
  Top 0.125: R62.1 R59.2 R64.1 R61.2
E51
  Top 0.125: R66.2 R64.2 R69.1 R67.1
E52
  Top 0.125: R72.1 R69.2 R74.1 R71.2
E53
  Top 0.125: R76.2 R74.2 R79.1 R77.1
E54
  Top 0.125: R82.1 R79.2 R84.1 R81.2
E55
  Top 0.125: R86.2 R84.2 R89.1 R87.1
E56
  Top 0.125: R92.1 R89.2 R94.1 R91.2
E57
  Top 0.125: R97.2 R94.2 R99.1 R98.1
E58
  Top 0.125: R102.1 R99.2 R104.1 R101.2
E59
  Top 0.125: R106.2 R104.2 R109.1 R107.1
E60
  Top 0.125: R112.1 R109.2 R114.1 R111.2
E61
  Top 0.125: R116.2 R114.2 R119.1 R117.1
E63
  Top 0.125: R126.2 R124.2 R129.1 R127.1
E64
  Top 0.125: R132.1 R129.2 R134.1 R131.2
E65
  Top 0.125: R136.2 R134.2 R139.1 R137.1
E66
  Top 0.125: R142.1 R139.2 R144.1 R141.2
E67
  Top 0.125: R147.2 R144.2 R149.1 R148.1
E68
  Top 0.125: R152.1 R149.2 R154.1 R151.2
E69
  Top 0.125: R156.2 R154.2 R159.1 R157.1
GND  (via drill 0.6)
  Top 0.125: R3.2 R8.2 R13.2 R18.2 R23.2 R28.2 R33.2 R38.2 R43.2 R46.2 R53.2 R58.2 R63.2 R68.2 R73.2 R78.2 R83.2 R88.2 R93.2 R96.2 R103.2 R108.2 R113.2 R118.2 R123.2 R128.2 R133.2 R138.2 R143.2 R146.2 R153.2 R158.2 68.35,32.65 v68.38,32.62
  Bottom 0.125: v68.38,32.62 68.38,34.5 v65.25,37.62
N$1
  Top 0.125: R122.1 R119.2 R124.1 R121.2
N$2
  Top 0.125: R5.1 R2.2 | R3.1 R5.1 | R5.1 4,29.75 4,33.5 4.5,34.12 68.75,34.12 69.5,33.38 69.5,30.35 R160.2
N$3
  Top 0.125: R8.1 R10.1 R5.2 R7.2
N$4
  Top 0.125: R13.1 R10.2 R15.1 R12.2
N$5
  Top 0.125: R18.1 R20.1 R15.2 R17.2
N$6
  Top 0.125: R23.1 R20.2 R25.1 R22.2
N$7
  Top 0.125: R28.1 R30.1 R25.2 R27.2
N$8
  Top 0.125: R33.1 R30.2 R35.1 R32.2
N$9
  Top 0.125: R38.1 R40.1 R35.2 R37.2
N$10
  Top 0.125: R43.1 R40.2 R45.1 R42.2
N$12
  Top 0.125: R53.1 R50.2 R55.1 R52.2
N$13
  Top 0.125: R57.2 R55.2 R60.1 R58.1
N$14
  Top 0.125: R63.1 R60.2 R65.1 R62.2
N$15
  Top 0.125: R67.2 R65.2 R70.1 R68.1
N$16
  Top 0.125: R73.1 R70.2 R75.1 R72.2
N$17
  Top 0.125: R77.2 R75.2 R80.1 R78.1
N$18
  Top 0.125: R83.1 R80.2 R85.1 R82.2
N$19
  Top 0.125: R87.2 R85.2 R90.1 R88.1
N$20
  Top 0.125: R93.1 R90.2 R95.1 R92.2
N$21
  pour Top: -1.5,62.5 75,62.5 75,-1.5 -1.5,-1.5
N$22
  Top 0.125: R103.1 R100.2 R105.1 R102.2
N$23
  Top 0.125: R107.2 R105.2 R110.1 R108.1
N$24
  Top 0.125: R113.1 R110.2 R115.1 R112.2
N$25
  Top 0.125: R117.2 R115.2 R120.1 R118.1
N$26
  Top 0.125: R123.1 R120.2 R125.1 R122.2
N$28
  Top 0.125: R127.2 R125.2 R130.1 R128.1
N$29
  Top 0.125: R133.1 R130.2 R135.1 R132.2
N$30
  Top 0.125: R137.2 R135.2 R140.1 R138.1
N$31
  Top 0.125: R143.1 R140.2 R145.1 R142.2
N$33
  Top 0.125: R153.1 R150.2 R155.1 R152.2
N$34
  Top 0.125: R157.2 R155.2 R160.1 R158.1
N$35
  pour Bottom: -2,63 75.5,63 75.5,-2 -2,-2
SW_IN1
  Top 0.125: R48.2 R45.2 R50.1 R46.1
SW_IN2
  Top 0.125: R98.2 R95.2 R100.1 R96.1
SW_IN3
  Top 0.125: R148.2 R145.2 R150.1 R146.1

### Text on the board
tNames: GND | GND | GND
bNames: 1 | 31 | 2 | 32 | 1 | 31 | 2 | 32